# EAGLE design OmneticsAdaptorSingleHeadstage (EAGLE 7.6.0)
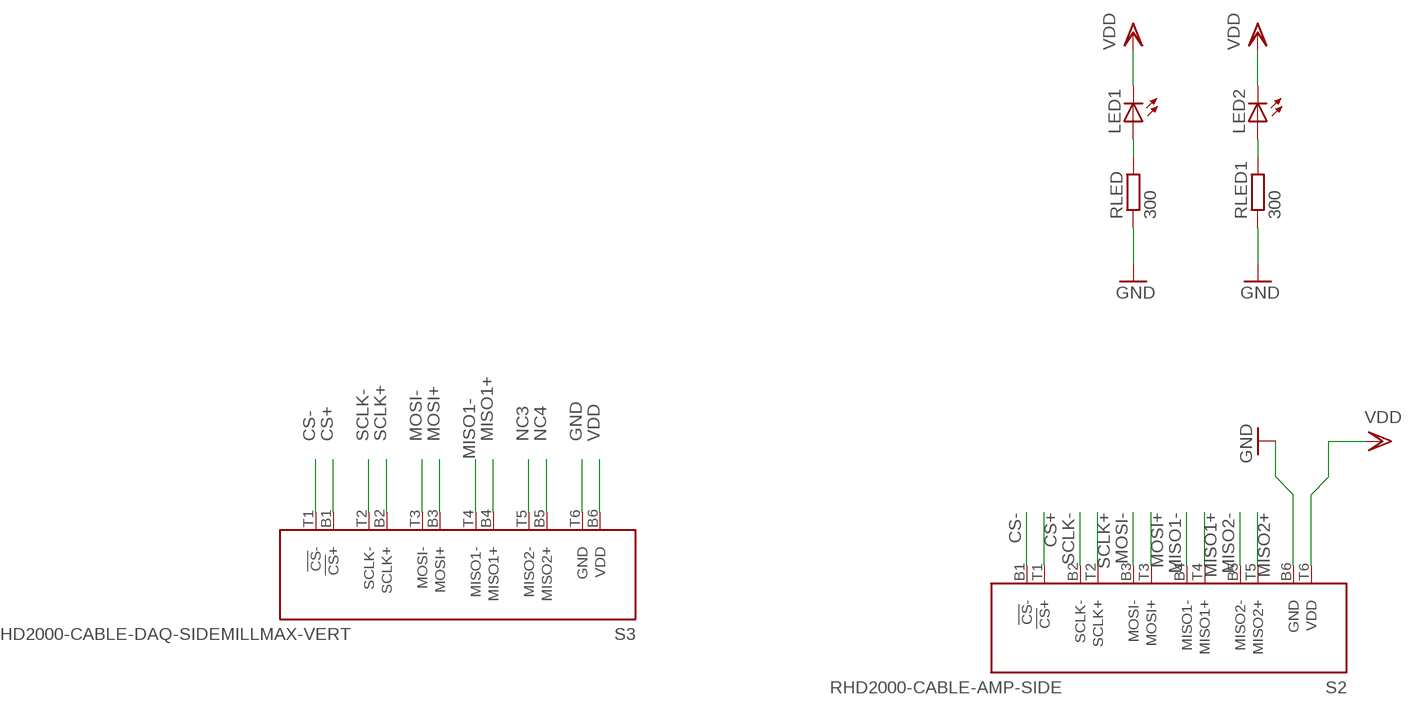
[diagram p0: schematic, sheet 1]

## Parts
LED1  LEDCHIPLED_0805  [CHIPLED_0805]
LED2  LEDCHIPLED_0805  [CHIPLED_0805]
RLED  300  R-EU_R0402  [R0402]
RLED1  300  R-EU_R0402  [R0402]
S2  RHD2000-CABLE-AMP-SIDE  [OMNETICS_PZN-12-AA]
S3  RHD2000-CABLE-DAQ-SIDEMILLMAX-VERT  [MILLMAX-12PIN-VERT]

## Nets
CS+: S2.T1(!CS!+) S3.B1(!CS!+)
CS-: S2.B1(!CS!-) S3.T1(!CS!-)
GND: RLED1.1 RLED.1 S2.B6(GND) S3.T6(GND)
LEDOUT: LED1.A RLED.2
LEDOUT1: LED2.A RLED1.2
MISO1+: S2.T4(MISO1+) S3.B4(MISO1+)
MISO1-: S2.B4(MISO1-) S3.T4(MISO1-)
MISO2+: S2.T5(MISO2+)
MISO2-: S2.B5(MISO2-)
MOSI+: S2.T3(MOSI+) S3.B3(MOSI+)
MOSI-: S2.B3(MOSI-) S3.T3(MOSI-)
NC3: S3.T5(MISO2-)
NC4: S3.B5(MISO2+)
SCLK+: S2.T2(SCLK+) S3.B2(SCLK+)
SCLK-: S2.B2(SCLK-) S3.T2(SCLK-)
VDD: LED1.C LED2.C S2.T6(VDD) S3.B6(VDD)

## Library data of the parts
LED1 LED2 = led:LED: LED OSRAM: - CHIPLED LG R971, LG N971, LY N971, LG Q971, LY Q971, LO R971, LY R971 LH N974, LH R974 LS Q976, LO Q976, LY Q976 LO Q996 - Hyper CHIPLED LW Q18S LB Q993, LB Q99A, LB R99A - SideLED LS A670, LO A670, LY A670, LG A670, LP A670 LB A673, LV A673, LT A673, LW A673 LH A674 LY A675 LS A676, LA A676, LO A676, LY A676, LW A676 LS A679, LY A679, LG A679 - Hyper Micro SIDELED® LS Y876, LA Y876, LO Y876, LY Y876 LT Y87S - SmartLED LW L88C, LW L88S LB L89C, LB L89S, LG L890 LS L89K, LO L89K, LY L89K LS L896, LA L896, LO L896, LY L896 - TOPLED LS T670, LO T670, LY T670, LG T670, LP T670 LSG T670, LSP T670, LSY T670, LOP T670, LYG T670 LG T671, LOG T671, LSG T671 LB T673, LV T673, LT T673, LW T673 LH T674 LS T676, LA T676, LO T676, LY T676, LB T676, LH T676, LSB T676, LW T676 LB T67C, LV T67C, LT T67C, LS T67K, LO T67K, LY T67K, LW E67C LS E67B, LA E67B, LO E67B, LY E67B, LB E67C, LV E67C, LT E67C LW T67C LS T679, LY T679, LG T679 LS T770, LO T770, LY T770, LG T770, LP T770 LB T773, LV T773, LT T773, LW T773 LH T774 LS E675, LA E675, LY E675, LS T675 LS T776, LA T776, LO T776, LY T776, LB T776 LHGB T686 LT T68C, LB T68C - Hyper Mini TOPLED® LB M676 - Mini TOPLED Santana® LG M470 LS M47K, LO M47K, LY M47K Source: http://www.osram.convergy.de LUXEON: - LUMILED® LXK2-PW12-R00, LXK2-PW12-S00, LXK2-PW14-U00, LXK2-PW14-V00 LXK2-PM12-R00, LXK2-PM12-S00, LXK2-PM14-U00 LXK2-PE12-Q00, LXK2-PE12-R00, LXK2-PE12-S00, LXK2-PE14-T00, LXK2-PE14-U00 LXK2-PB12-K00, LXK2-PB12-L00, LXK2-PB12-M00, LXK2-PB14-N00, LXK2-PB14-P00, LXK2-PB14-Q00 LXK2-PR12-L00, LXK2-PR12-M00, LXK2-PR14-Q00, LXK2-PR14-R00 LXK2-PD12-Q00, LXK2-PD12-R00, LXK2-PD12-S00 LXK2-PH12-R00, LXK2-PH12-S00 LXK2-PL12-P00, LXK2-PL12-Q00, LXK2-PL12-R00 Source: www.luxeon.com KINGBRIGHT: KA-3528ASYC Source: www.kingbright.com
RLED RLED1 = resistor:R-EU_: RESISTOR, European symbol
S2 = headstage:RHD2000-CABLE-AMP-SIDE
S3 = RHD2000:RHD2000-CABLE-DAQ-SIDE: Omnetics A79623 PZN-12-AA connector for SPI interface (controller side)

## Board
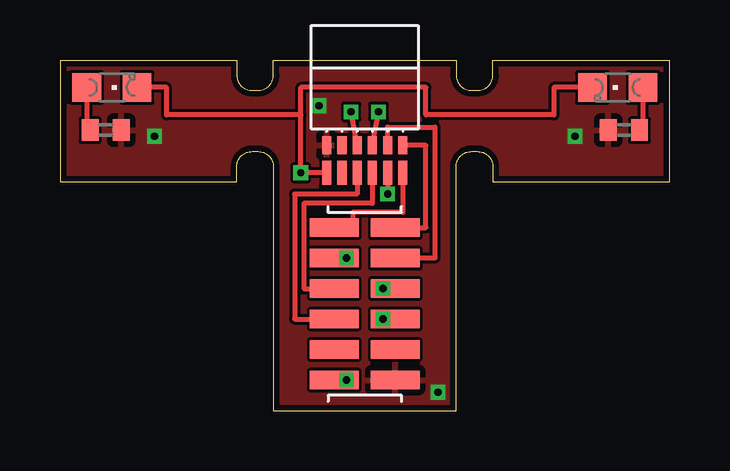
[diagram p1: board, top side]
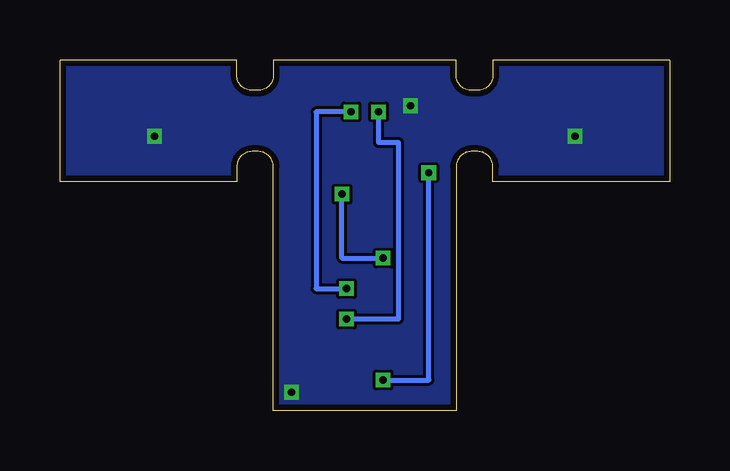
[diagram p2: board, bottom side, seen from below]

Size 25.4 x 14.61 mm. Coordinates in mm from the lower left corner, seen from the top.
Outline: 0,14.61 0,9.53 7.37,9.53 7.37,10.16 arc-90 8,10.79 8.26,10.79 arc-90 8.89,10.16 8.89,0 16.51,0 16.51,10.16 arc-90 17.14,10.79 17.4,10.79 arc-90 18.03,10.16 18.03,9.53 25.4,9.53 25.4,14.61 18.03,14.61 18.03,13.97 arc-90 17.4,13.34 17.14,13.34 arc-90 16.51,13.97 16.51,14.61 8.89,14.61 8.89,13.97 arc-90 8.26,13.34 8,13.34 arc-90 7.37,13.97 7.37,14.61 0,14.61
Copper layers (1*16): Top 0.035mm / dielectric 1.5mm / Bottom 0.035mm
Design rules "MF_Standard_2_Layer": minimum track width 5mil, minimum drill 12mil, track to track 5mil, track to pad 5mil, pad to pad 5mil, via to via 5mil, smd to smd 0mil, copper to edge 10mil, drill to drill 10mil, minimum pad ring 6mil, minimum via ring 6mil, stop-mask expansion 2mil, vias tented up to drill 25mil, thermal gap 10mil

### Footprints (pad centres in the part's own frame; a part is rotated, then mirrored left to right if it is on the bottom)
CHIPLED_0805 = smd 1.2 x 1.2: A 0,-1.05; C 0,1.05
R0402 = smd 0.7 x 0.9: 1 -0.65,0; 2 0.65,0
OMNETICS_PZN-12-AA = smd 0.381 x 0.762: B1 1.587,-1.016; B2 0.953,-1.016; B3 0.318,-1.016; B4 -0.318,-1.016; B5 -0.953,-1.016; B6 -1.587,-1.016 | smd 0.381 x 1.016: T1 1.587,-2.159; T2 0.953,-2.159; T3 0.318,-2.159; T4 -0.318,-2.159; T5 -0.953,-2.159; T6 -1.587,-2.159
MILLMAX-12PIN-VERT = smd 0.762 x 2.032: B1 3.175,1.27; B2 1.905,1.27; B3 0.635,1.27; B4 -0.635,1.27; B5 -1.905,1.27; B6 -3.175,1.27; T1 3.175,-1.27; T2 1.905,-1.27; T3 0.635,-1.27; T4 -0.635,-1.27; T5 -1.905,-1.27; T6 -3.175,-1.27

### Placement (x,y rotation side)
LED1  23.24,13.46 90 top
LED2  2.16,13.46 270 top
RLED  23.5,11.68 0 top
RLED1  1.91,11.68 180 top
S2  12.7,12.06 0 top
S3  12.7,4.45 90 top

### Tracks (layer width: path | path; a pad name or v marks a point on that pad's centre or on a via)
CS+
  Top 0.203: S2.T1 14.29,8.26 12.19,8.26 12.19,7.62 S3.B1
CS-
  Top 0.203: S3.T1 15.24,7.62 15.24,11.05 S2.B1
GND  (via drill 0.3)
  other vias: 3.94,11.43 10.79,12.7 15.75,0.76 21.46,11.43
  pour Top: 0,0 25.4,0 25.4,14.61 0,14.61
  pour Bottom: 0,0 25.4,0 25.4,14.61 0,14.61
LEDOUT
  Top 0.203: LED1.A 24.29,11.68 RLED.2
LEDOUT1
  Top 0.203: LED2.A 1.11,11.94 RLED1.2
MISO1+
  Top 0.203: S2.T4 12.38,9.02 9.78,9.02 9.78,3.81 S3.B4
MISO1-  (via drill 0.3)
  Top 0.203: S2.B4 v12.13,12.45 | v13.46,3.81 13.59,4.06 13.84,4.06 13.84,3.81 S3.T4
  Bottom 0.203: v13.46,3.81 11.3,3.81 11.3,11.18 12.13,11.18 v12.13,12.45
MOSI+
  Top 0.203: S2.T3 13.02,8.64 10.16,8.64 10.16,5.08 S3.B3
MOSI-  (via drill 0.3)
  Top 0.203: S2.B3 v13.27,12.45 | v13.46,5.08 S3.T3
  Bottom 0.203: v13.27,12.45 14.73,12.45 14.73,5.08 v13.46,5.08
SCLK+  (via drill 0.3)
  Top 0.203: S2.T2 v13.65,9.02 | v11.94,6.35 11.94,6.6 11.68,6.6 11.68,6.35 S3.B2
  Bottom 0.203: v11.94,6.35 13.65,6.35 v13.65,9.02
SCLK-
  Top 0.203: S2.B2 13.65,11.81 15.62,11.81 15.62,6.35 S3.T2
VDD  (via drill 0.3)
  Top 0.203: LED1.C 20.57,13.46 20.57,12.32 15.24,12.32 15.24,13.46 10.03,13.46 10.03,12.32 | 10.03,12.32 4.45,12.32 4.45,13.46 LED2.C | S2.T6 v10.03,9.91 10.03,12.32 | S3.B6 v11.94,1.27
  Bottom 0.203: v11.94,1.27 10.03,1.27 v10.03,9.91